# Altium schematic sheet USBC_B.SchDoc: DARKYDEN_USBC_B (part 1 of 3)
size Letter; ApprovedBy: APPROUVÉ PAR; Author: Harold Malbrouck; Organization: Cegep Limoilou; Address1: 1300, 8e Avenue; Address2: Québec, QC; Address3: Canada; Address4: G1J 5L5; Revision: Rev.E; SheetNumber: 8; SheetTotal: 21
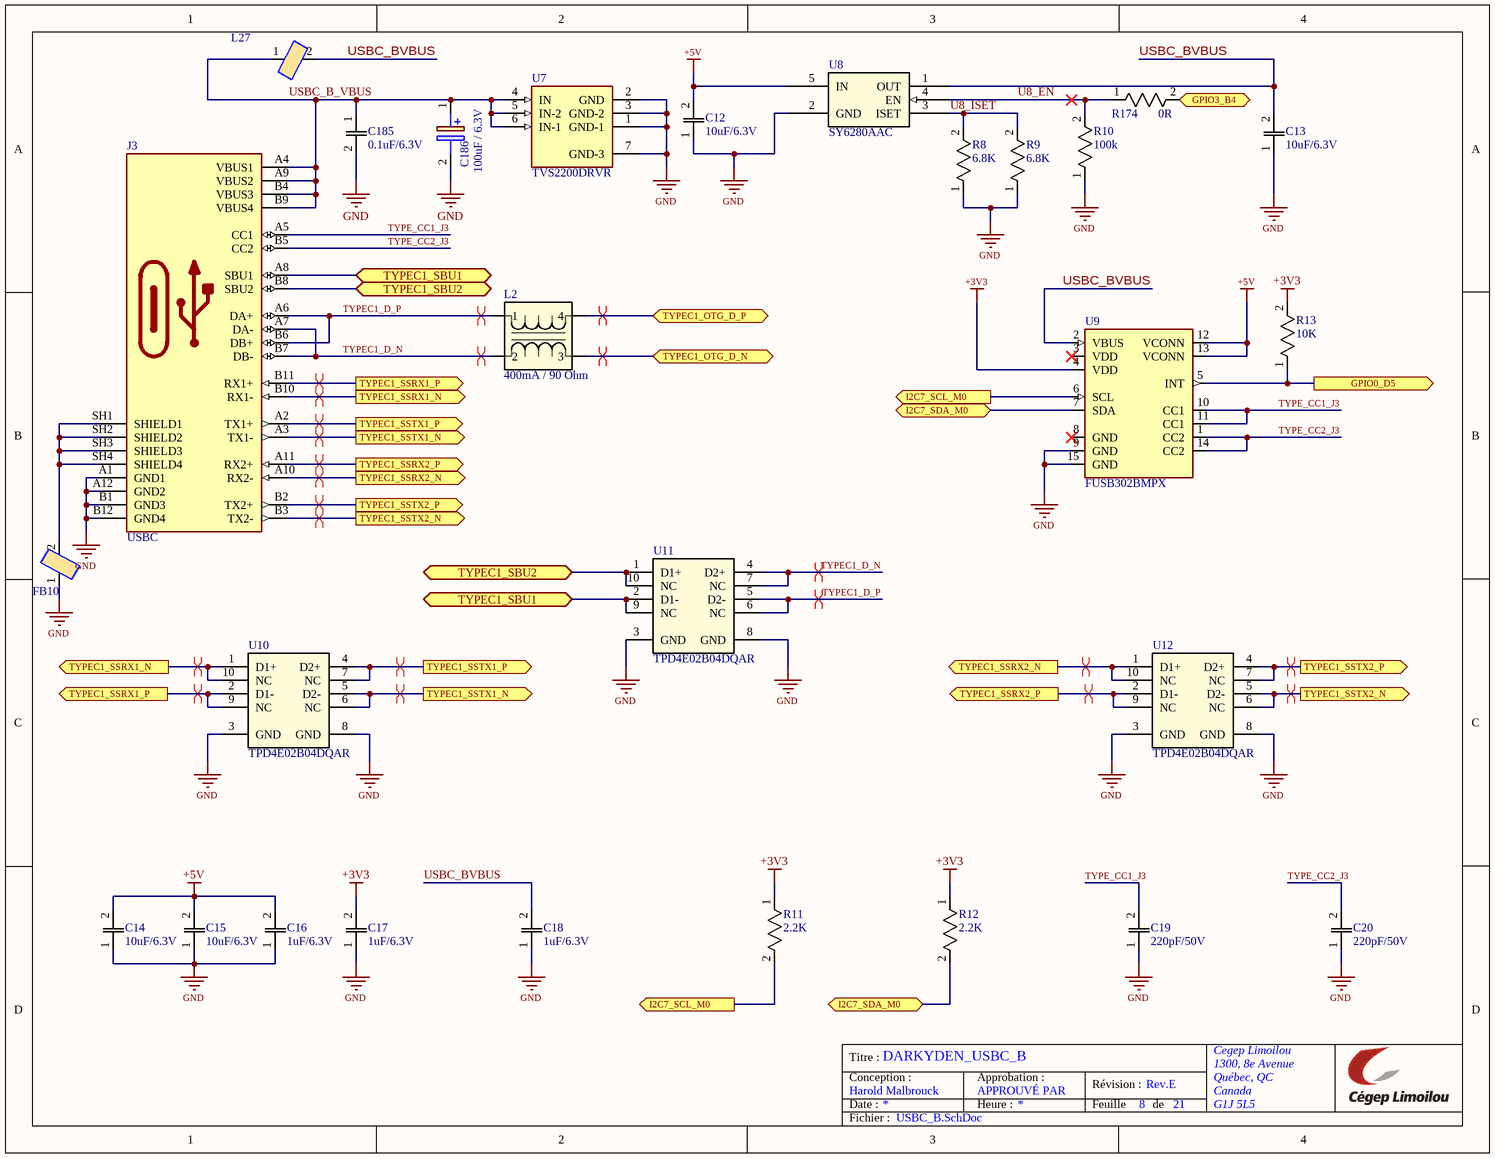
[diagram p0: USBC_B.SchDoc]

## Parts
C12  10uF/6.3V  [C0805]
C13  10uF/6.3V  [C0805]
C14  10uF/6.3V  [C0805]
C15  10uF/6.3V  [C0805]
C16  1uF/6.3V  [C0805]
C17  1uF/6.3V  [C0805]
C18  1uF/6.3V  [C0805]
C19  220pF/50V  [C0805]
C20  220pF/50V  [C0805]
C185  0.1uF/6.3V  [C0805]
C186  100uF / 6.3V  [EEE0GA101SR]
FB10  220R / 100MHz  [BLM18SP221SN1B]  (value not drawn)
J3  USBC  [USB_C]
L2  400mA / 90 Ohm  [ACM20129002PT002]
L27  FBMJ2125HM210NT  [INDC2012X105N]  (value not drawn)
R8  6.8K  [RESC1608X55N]
R9  6.8K  [RESC1608X55N]
R10  100k  [RESC1608X55N]
R11  2.2K  [RESC1608X55N]
R12  2.2K  [RESC1608X55N]
R13  10K  [RESC1608X55N]
R174  0R  [RESC1608X55N]
U7  TVS2200DRVR  [SON65P200X200X80-7N]
U8  SY6280AAC  [SOT95P285X140-5N]
U9  FUSB302BMPX  [QFN50P250X250X80-15N]
U10  TPD4E02B04DQAR  [DQA0010A]
U11  TPD4E02B04DQAR  [DQA0010A]
U12  TPD4E02B04DQAR  [DQA0010A]

## Ports
GPIO0_D5 (out, see CONNECTEUR_3[3C]), GPIO3_B4 (bidir, see CONNECTEUR_4[3C]), I2C7_SCL_M0 (out, see CONNECTEUR_2[1A], USBC_B[2D]), I2C7_SCL_M0 (out, see CONNECTEUR_2[1A], USBC_B[3B]), I2C7_SDA_M0 (bidir, see CONNECTEUR_2[1A], USBC_B[3B]), I2C7_SDA_M0 (bidir, see CONNECTEUR_2[1A], USBC_B[3D]), TYPEC1_OTG_D_N (bidir, see CONNECTEUR_2[3C]), TYPEC1_OTG_D_P (bidir, see CONNECTEUR_2[3C]), TYPEC1_SBU1 (bidir, see CONNECTEUR_4[3A], USBC_B[1A]), TYPEC1_SBU1 (bidir, see CONNECTEUR_4[3A], USBC_B[2C]), TYPEC1_SBU2 (bidir, see CONNECTEUR_4[3A], USBC_B[1A]), TYPEC1_SBU2 (bidir, see CONNECTEUR_4[3A], USBC_B[2B]), TYPEC1_SSRX1_N (out, see CONNECTEUR_2[1C], USBC_B[1B]), TYPEC1_SSRX1_N (out, see CONNECTEUR_2[1C], USBC_B[1C]), TYPEC1_SSRX1_P (out, see CONNECTEUR_2[1C], USBC_B[1B]), TYPEC1_SSRX1_P (out, see CONNECTEUR_2[1C], USBC_B[1C]), TYPEC1_SSRX2_N (out, see CONNECTEUR_2[1C], USBC_B[1B]), TYPEC1_SSRX2_N (out, see CONNECTEUR_2[1C], USBC_B[3C]), TYPEC1_SSRX2_P (out, see CONNECTEUR_2[1C], USBC_B[1B]), TYPEC1_SSRX2_P (out, see CONNECTEUR_2[1C], USBC_B[3C]), TYPEC1_SSTX1_N (out, see CONNECTEUR_2[1C], USBC_B[1B]), TYPEC1_SSTX1_N (out, see CONNECTEUR_2[1C], USBC_B[2C]), TYPEC1_SSTX1_P (out, see CONNECTEUR_2[1C], USBC_B[1B]), TYPEC1_SSTX1_P (out, see CONNECTEUR_2[1C], USBC_B[2C]), TYPEC1_SSTX2_N (out, see CONNECTEUR_2[1C], USBC_B[1B]), TYPEC1_SSTX2_N (out, see CONNECTEUR_2[1C], USBC_B[4C]), TYPEC1_SSTX2_P (out, see CONNECTEUR_2[1C], USBC_B[1B]), TYPEC1_SSTX2_P (out, see CONNECTEUR_2[1C], USBC_B[4C])

## Nets
+3V3: C17.2 R11.1 R12.1 R13.2 U9.4(VDD)
+5V: C12.2 C14.2 C15.2 C16.2 U8.5(IN) U9.12(VCONN) U9.13(VCONN)
GND: C12.1 C13.1 C14.1 C15.1 C16.1 C17.1 C18.1 C19.1 C20.1 C185.2 C186.2(-) FB10.1 J3.A1(GND1) J3.A12(GND2) J3.B1(GND3) J3.B12(GND4) R8.1 R9.1 R10.1 U7.1(GND-1) U7.2(GND) U7.3(GND-2) U7.7(GND-3) U8.2(GND) U9.9(GND) U9.15(GND) U10.3(GND) U10.8(GND) U11.3(GND) U11.8(GND) U12.3(GND) U12.8(GND)
GPIO0_D5: R13.1 U9.5(INT) ; port GPIO0_D5
GPIO3_B4: R174.2 ; port GPIO3_B4
I2C7_SCL_M0: R11.2 U9.6(SCL) ; port I2C7_SCL_M0
I2C7_SDA_M0: R12.2 U9.7(SDA) ; port I2C7_SDA_M0
TYPE_CC1_J3: C19.2 J3.A5(CC1) U9.10(CC1) U9.11(CC1)
TYPE_CC2_J3: C20.2 J3.B5(CC2) U9.1(CC2) U9.14(CC2)
TYPEC1_D_N: J3.A7(DA-) J3.B7(DB-) L2.2 U11.4(D2+) U11.7(NC)
TYPEC1_D_P: J3.A6(DA+) J3.B6(DB+) L2.1 U11.5(D2-) U11.6(NC)
TYPEC1_OTG_D_N: L2.3 ; port TYPEC1_OTG_D_N
TYPEC1_OTG_D_P: L2.4 ; port TYPEC1_OTG_D_P
TYPEC1_SBU1: J3.A8(SBU1) U11.2(D1-) U11.9(NC) ; port TYPEC1_SBU1
TYPEC1_SBU2: J3.B8(SBU2) U11.1(D1+) U11.10(NC) ; port TYPEC1_SBU2
TYPEC1_SSRX1_N: J3.B10(RX1-) U10.1(D1+) U10.10(NC) ; port TYPEC1_SSRX1_N
TYPEC1_SSRX1_P: J3.B11(RX1+) U10.2(D1-) U10.9(NC) ; port TYPEC1_SSRX1_P
TYPEC1_SSRX2_N: J3.A10(RX2-) U12.1(D1+) U12.10(NC) ; port TYPEC1_SSRX2_N
TYPEC1_SSRX2_P: J3.A11(RX2+) U12.2(D1-) U12.9(NC) ; port TYPEC1_SSRX2_P
TYPEC1_SSTX1_N: J3.A3(TX1-) U10.5(D2-) U10.6(NC) ; port TYPEC1_SSTX1_N
TYPEC1_SSTX1_P: J3.A2(TX1+) U10.4(D2+) U10.7(NC) ; port TYPEC1_SSTX1_P
TYPEC1_SSTX2_N: J3.B3(TX2-) U12.5(D2-) U12.6(NC) ; port TYPEC1_SSTX2_N
TYPEC1_SSTX2_P: J3.B2(TX2+) U12.4(D2+) U12.7(NC) ; port TYPEC1_SSTX2_P
U8_EN: R10.2 R174.1 U8.4(EN)
U8_ISET: R8.2 R9.2 U8.3(ISET)
USBC_B_VBUS: C185.1 C186.1(+) J3.A4(VBUS1) J3.A9(VBUS2) J3.B4(VBUS3) J3.B9(VBUS4) L27.1 U7.4(IN) U7.5(IN-2) U7.6(IN-1)
USBC_BVBUS: C13.2 C18.2 L27.2 U8.1(OUT) U9.2(VBUS)
NetFB10_2: FB10.2 J3.SH1(SHIELD1) J3.SH2(SHIELD2) J3.SH3(SHIELD3) J3.SH4(SHIELD4)

Not connected (* = marked no-connect by the designer): U9 3(VDD)* 8(GND)*

## Layout directives
differential pair; differential pair class USBC_B: TYPEC1_D_N, TYPEC1_D_P, TYPEC1_OTG_D_N, TYPEC1_OTG_D_P, TYPEC1_SSRX1_N, TYPEC1_SSRX1_P, TYPEC1_SSRX2_N, TYPEC1_SSRX2_P, TYPEC1_SSTX1_N, TYPEC1_SSTX1_P, TYPEC1_SSTX2_N, TYPEC1_SSTX2_P

## Notes on the sheet
- Titre :
- Conception :
- Date :
- Approbation :
- Heure :
- Révision :
- Feuille
- de
- Fichier :